# EAGLE schematic main (EAGLE 8.7.0)
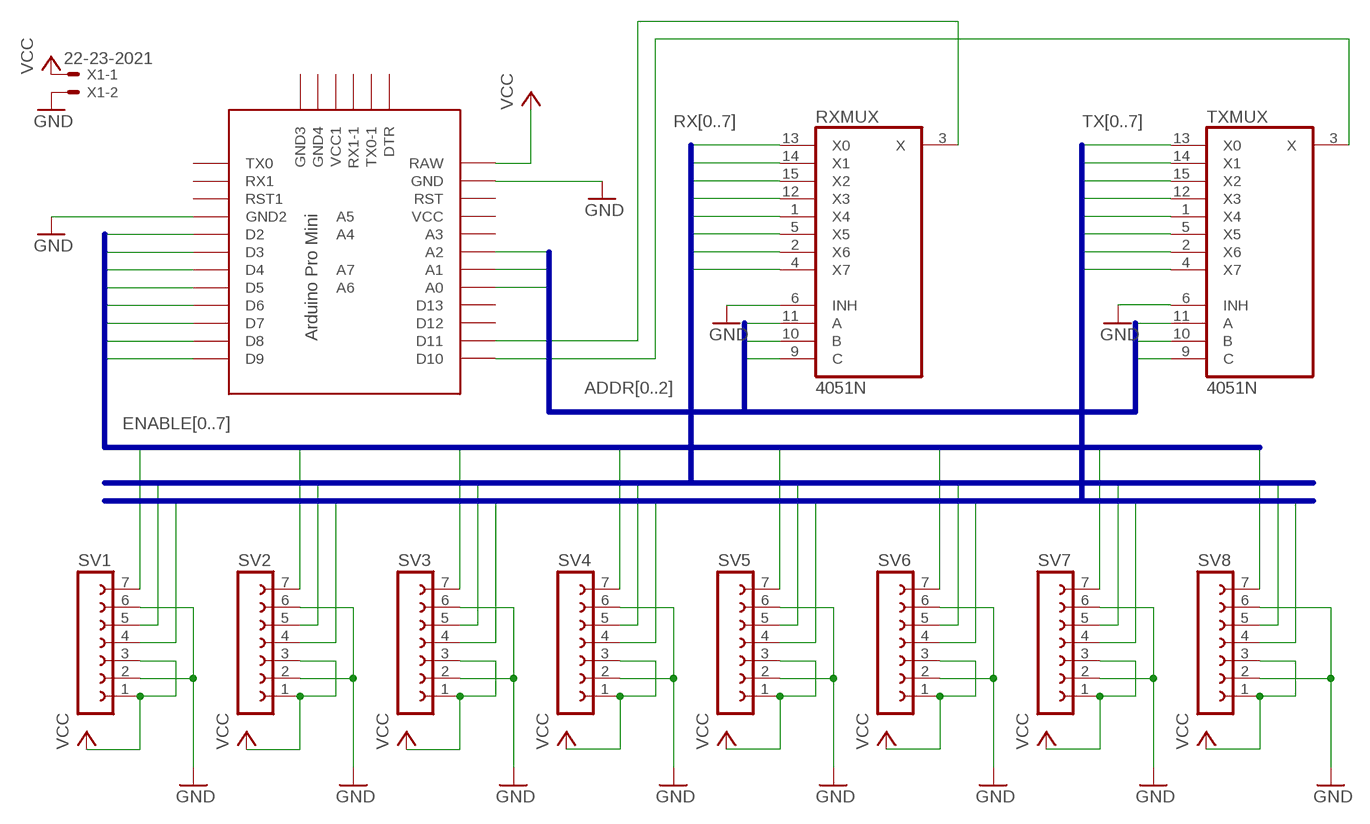
[diagram p0: schematic, sheet 1]

## Parts
RXMUX  4051N  [DIL16]
SV1  FE07-1  [FE07]
SV2  FE07-1  [FE07]
SV3  FE07-1  [FE07]
SV4  FE07-1  [FE07]
SV5  FE07-1  [FE07]
SV6  FE07-1  [FE07]
SV7  FE07-1  [FE07]
SV8  FE07-1  [FE07]
TXMUX  4051N  [DIL16]
U$1  PRO-MINI-2  [PRO-MINI-2]
X1  22-23-2021  [22-23-2021]

## Nets
ADDR0: RXMUX.11(A) TXMUX.11(A) U$1.A2
ADDR1: RXMUX.10(B) TXMUX.10(B) U$1.A1
ADDR2: RXMUX.9(C) TXMUX.9(C) U$1.A0
ENABLE0: SV1.7 U$1.D2
ENABLE1: SV2.7 U$1.D3
ENABLE2: SV3.7 U$1.D4
ENABLE3: SV4.7 U$1.D5
ENABLE4: SV5.7 U$1.D6
ENABLE5: SV6.7 U$1.D7
ENABLE6: SV7.7 U$1.D8
ENABLE7: SV8.7 U$1.D9
GND: RXMUX.6(INH) SV1.2 SV1.6 SV2.2 SV2.6 SV3.2 SV3.6 SV4.2 SV4.6 SV5.2 SV5.6 SV6.2 SV6.6 SV7.2 SV7.6 SV8.2 SV8.6 TXMUX.6(INH) U$1.GND U$1.GND1(GND2) X1.2
N$1: RXMUX.3(X) U$1.D11
N$2: TXMUX.3(X) U$1.D10
RX0: RXMUX.13(X0) SV1.5
RX1: RXMUX.14(X1) SV2.5
RX2: RXMUX.15(X2) SV3.5
RX3: RXMUX.12(X3) SV4.5
RX4: RXMUX.1(X4) SV5.5
RX5: RXMUX.5(X5) SV6.5
RX6: RXMUX.2(X6) SV7.5
RX7: RXMUX.4(X7) SV8.5
TX0: SV1.4 TXMUX.13(X0)
TX1: SV2.4 TXMUX.14(X1)
TX2: SV3.4 TXMUX.15(X2)
TX3: SV4.4 TXMUX.12(X3)
TX4: SV5.4 TXMUX.1(X4)
TX5: SV6.4 TXMUX.5(X5)
TX6: SV7.4 TXMUX.2(X6)
TX7: SV8.4 TXMUX.4(X7)
VCC: SV1.1 SV1.3 SV2.1 SV2.3 SV3.1 SV3.3 SV4.1 SV4.3 SV5.1 SV5.3 SV6.1 SV6.3 SV7.1 SV7.3 SV8.1 SV8.3 U$1.RAW X1.1
Unconnected: U$1.A3 U$1.A4 U$1.A5 U$1.A6 U$1.A7 U$1.D12 U$1.D13 U$1.DTR U$1.GND2(GND3) U$1.GND3(GND4) U$1.RST U$1.RST1 U$1.RX1 U$1.RX1-1 U$1.TX0 U$1.TX0-1 U$1.VCC U$1.VCC1

## Buses
ADDR[0..2]
ENABLE[0..7]
TX[0..7]
RX[0..7]

## Power pins joined to a net without a drawn wire
GND: RXMUX.8(GND) TXMUX.8(GND)
VCC: RXMUX.16(VCC) TXMUX.16(VCC)
VEE: RXMUX.7(VEE) TXMUX.7(VEE)

## Library data of the parts
RXMUX TXMUX = 40xx:4051: 8-channel ANALOG MULTIPLEXER
SV1-SV8 = con-lsta:FE07-1: FEMALE HEADER; OC_FARNELL: unknown; OC_NEWARK: unknown
U$1 = Arduino-clone:PRO-MINI-2: Arduino Pro Mini Layout 2 Sparkfun.com
X1 = con-molex:22-23-2021: .100" (2.54mm) Center Header - 2 Pin; MF: MOLEX; MPN: 22-23-2021; OC_FARNELL: 1462926; OC_NEWARK: 25C3832; SPICEPREFIX: X